# Altium project wirelessBoard II.PrjPcb
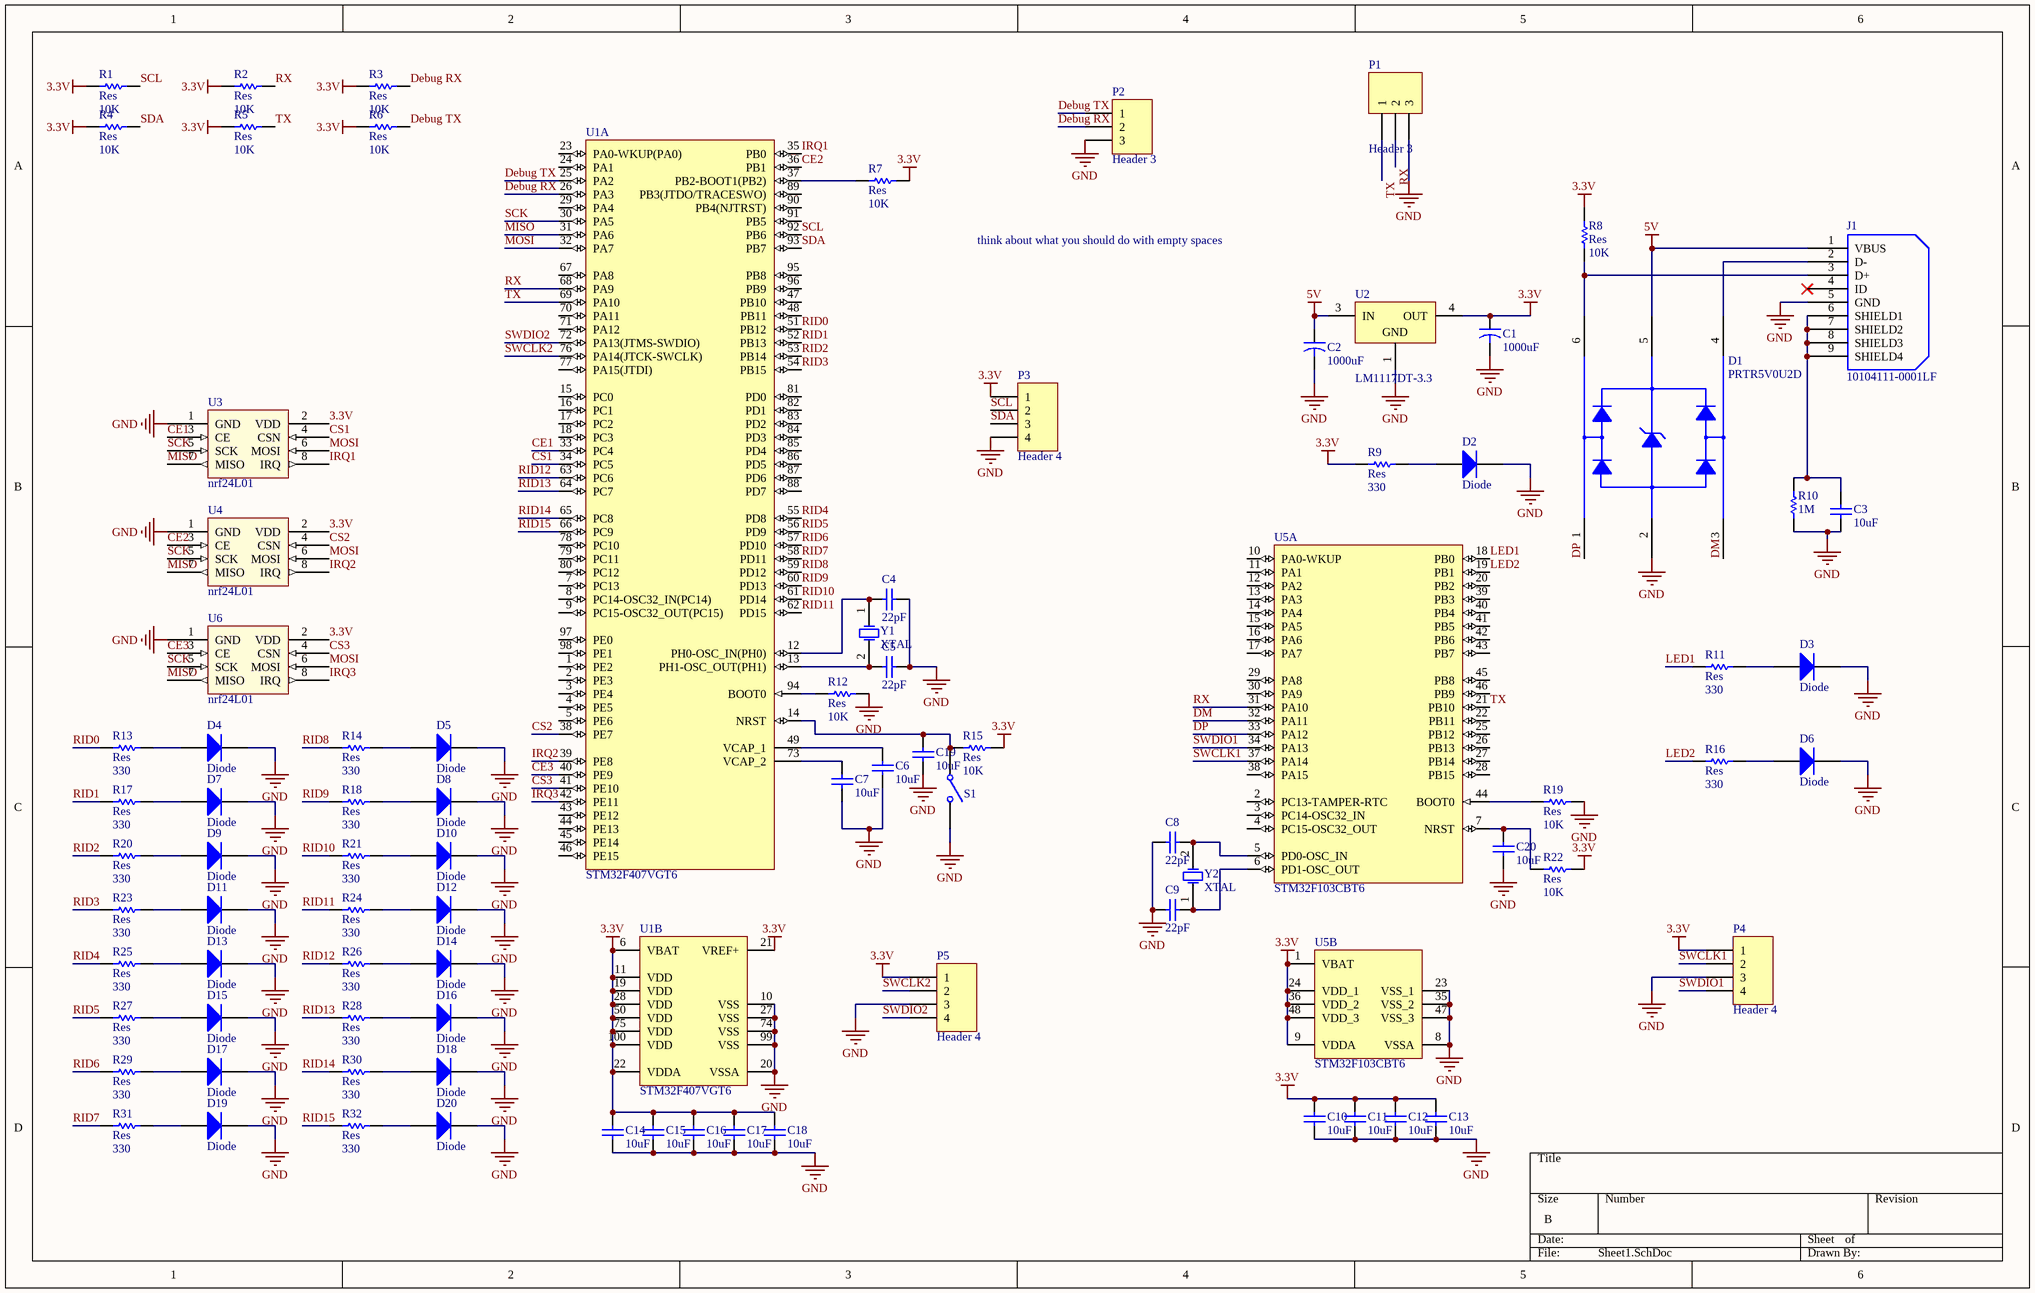
[diagram p0: Sheet1.SchDoc]
1 sheet, 87 parts. Net scope: global (net labels, ports and power ports of the same name join across sheets).
Board file: PCB1.PcbDoc

## Sheet Sheet1.SchDoc
size B

### Parts
C1  value 1000uF  [7343]  (hidden comment: Cap_El)
C2  value 1000uF  [7343]  (hidden comment: Cap_El)
C3  value 10uF  [2012[0805]]  (hidden comment: Cap_UP)
C4  value 22pF  [2012[0805]]  (hidden comment: Cap_UP)
C5  value 22pF  [2012[0805]]  (hidden comment: Cap_UP)
C6  value 10uF  [2012[0805]]  (hidden comment: Cap_UP)
C7  value 10uF  [2012[0805]]  (hidden comment: Cap_UP)
C8  value 22pF  [2012[0805]]  (hidden comment: Cap_UP)
C9  value 22pF  [2012[0805]]  (hidden comment: Cap_UP)
C10  value 10uF  [2012[0805]]  (hidden comment: Cap_UP)
C11  value 10uF  [2012[0805]]  (hidden comment: Cap_UP)
C12  value 10uF  [2012[0805]]  (hidden comment: Cap_UP)
C13  value 10uF  [2012[0805]]  (hidden comment: Cap_UP)
C14  value 10uF  [2012[0805]]  (hidden comment: Cap_UP)
C15  value 10uF  [2012[0805]]  (hidden comment: Cap_UP)
C16  value 10uF  [2012[0805]]  (hidden comment: Cap_UP)
C17  value 10uF  [2012[0805]]  (hidden comment: Cap_UP)
C18  value 10uF  [2012[0805]]  (hidden comment: Cap_UP)
C19  value 10uF  [2012[0805]]  (hidden comment: Cap_UP)
C20  value 10uF  [2012[0805]]  (hidden comment: Cap_UP)
D1  value PRTR5V0U2D  [PRTR5V0U2D]  (hidden comment: PRTR5V0U2X)
D2  Diode  [2012[0805]]
D3  Diode  [2012[0805]]
D4  Diode  [2012[0805]]
D5  Diode  [2012[0805]]
D6  Diode  [2012[0805]]
D7  Diode  [2012[0805]]
D8  Diode  [2012[0805]]
D9  Diode  [2012[0805]]
D10  Diode  [2012[0805]]
D11  Diode  [2012[0805]]
D12  Diode  [2012[0805]]
D13  Diode  [2012[0805]]
D14  Diode  [2012[0805]]
D15  Diode  [2012[0805]]
D16  Diode  [2012[0805]]
D17  Diode  [2012[0805]]
D18  Diode  [2012[0805]]
D19  Diode  [2012[0805]]
D20  Diode  [2012[0805]]
J1  value 10104111-0001LF  [USB_MINI]  (hidden comment: USB_AB)
P1  Header 3  [HDR1X3]
P2  Header 3  [HDR1X3]
P3  Header 4  [HDR1X4]
P4  Header 4  [HDR1X4]
P5  Header 4  [HDR1X4]
R1  Res  value 10K  [2012[0805]]
R2  Res  value 10K  [2012[0805]]
R3  Res  value 10K  [2012[0805]]
R4  Res  value 10K  [2012[0805]]
R5  Res  value 10K  [2012[0805]]
R6  Res  value 10K  [2012[0805]]
R7  Res  value 10K  [2012[0805]]
R8  Res  value 10K  [2012[0805]]
R9  Res  value 330  [2012[0805]]
R10  1M  [2012[0805]]
R11  Res  value 330  [2012[0805]]
R12  Res  value 10K  [2012[0805]]
R13  Res  value 330  [2012[0805]]
R14  Res  value 330  [2012[0805]]
R15  Res  value 10K  [2012[0805]]
R16  Res  value 330  [2012[0805]]
R17  Res  value 330  [2012[0805]]
R18  Res  value 330  [2012[0805]]
R19  Res  value 10K  [2012[0805]]
R20  Res  value 330  [2012[0805]]
R21  Res  value 330  [2012[0805]]
R22  Res  value 10K  [2012[0805]]
R23  Res  value 330  [2012[0805]]
R24  Res  value 330  [2012[0805]]
R25  Res  value 330  [2012[0805]]
R26  Res  value 330  [2012[0805]]
R27  Res  value 330  [2012[0805]]
R28  Res  value 330  [2012[0805]]
R29  Res  value 330  [2012[0805]]
R30  Res  value 330  [2012[0805]]
R31  Res  value 330  [2012[0805]]
R32  Res  value 330  [2012[0805]]
S1  SW-SPST  [SW-SMD]  (value not drawn)
U1  STM32F407VGT6  [STM-LQFP100_N]  (parts A,B of 2)
U2  LM1117DT-3.3  [SOT223]
U3  nrf24L01  [NRF24L01]
U4  nrf24L01  [NRF24L01]
U5  STM32F103CBT6  [STM-LQFP48_N]  (parts A,B of 2)
U6  nrf24L01  [NRF24L01]
Y1  XTAL  [XTALL]
Y2  XTAL  [XTALL]

### Nets
3.3V: C1.1 C10.2 C11.2 C12.2 C13.2 C14.2 C15.2 C16.2 C17.2 C18.2 P3.1 P4.1 P5.1 R1.1 R2.1 R3.1 R4.1 R5.1 R6.1 R7.1 R8.1 R9.1 R15.1 R22.1 U1.6(VBAT) U1.11(VDD) U1.19(VDD) U1.21(VREF+) U1.22(VDDA) U1.28(VDD) U1.50(VDD) U1.75(VDD) U1.100(VDD) U2.4(OUT) U3.2(VDD) U4.2(VDD) U5.1(VBAT) U5.9(VDDA) U5.24(VDD_1) U5.36(VDD_2) U5.48(VDD_3) U6.2(VDD)
5V: C2.1 D1.5(VCC) J1.1(VBUS) U2.3(IN)
GND: C1.2 C2.2 C3.1 C4.2 C5.2 C6.1 C7.1 C8.2 C9.2 C10.1 C11.1 C12.1 C13.1 C14.1 C15.1 C16.1 C17.1 C18.1 C19.1 C20.1 D1.2(GND) D2.2(K) D3.2(K) D4.2(K) D5.2(K) D6.2(K) D7.2(K) D8.2(K) D9.2(K) D10.2(K) D11.2(K) D12.2(K) D13.2(K) D14.2(K) D15.2(K) D16.2(K) D17.2(K) D18.2(K) D19.2(K) D20.2(K) J1.5(GND) P1.3 P2.3 P3.4 P4.3 P5.3 R10.1 R12.2 R19.2 S1.2(NO) U1.10(VSS) U1.20(VSSA) U1.27(VSS) U1.74(VSS) U1.99(VSS) U2.1(GND) U3.1(GND) U4.1(GND) U5.8(VSSA) U5.23(VSS_1) U5.35(VSS_2) U5.47(VSS_3) U6.1(GND)
CE1: U1.33(PC4) U3.3(CE)
CE2: U1.36(PB1) U4.3(CE)
CE3: U1.40(PE9) U6.3(CE)
CS1: U1.34(PC5) U3.4(CSN)
CS2: U1.38(PE7) U4.4(CSN)
CS3: U1.41(PE10) U6.4(CSN)
Debug RX: P2.2 R3.2 U1.26(PA3)
Debug TX: P2.1 R6.2 U1.25(PA2)
DM: D1.3(I/O2) U5.32(PA11)
DP: D1.1(I/O_1) U5.33(PA12)
IRQ1: U1.35(PB0) U3.8(IRQ)
IRQ2: U1.39(PE8) U4.8(IRQ)
IRQ3: U1.42(PE11) U6.8(IRQ)
LED1: R11.1 U5.18(PB0)
LED2: R16.1 U5.19(PB1)
MISO: U1.31(PA6) U3.7(MISO) U4.7(MISO) U6.7(MISO)
MOSI: U1.32(PA7) U3.6(MOSI) U4.6(MOSI) U6.6(MOSI)
RID0: R13.1 U1.51(PB12)
RID1: R17.1 U1.52(PB13)
RID2: R20.1 U1.53(PB14)
RID3: R23.1 U1.54(PB15)
RID4: R25.1 U1.55(PD8)
RID5: R27.1 U1.56(PD9)
RID6: R29.1 U1.57(PD10)
RID7: R31.1 U1.58(PD11)
RID8: R14.1 U1.59(PD12)
RID9: R18.1 U1.60(PD13)
RID10: R21.1 U1.61(PD14)
RID11: R24.1 U1.62(PD15)
RID12: R26.1 U1.63(PC6)
RID13: R28.1 U1.64(PC7)
RID14: R30.1 U1.65(PC8)
RID15: R32.1 U1.66(PC9)
RX: P1.2 R2.2 U1.68(PA9) U5.31(PA10)
SCK: U1.30(PA5) U3.5(SCK) U4.5(SCK) U6.5(SCK)
SCL: P3.2 R1.2 U1.92(PB6)
SDA: P3.3 R4.2 U1.93(PB7)
SWCLK1: P4.2 U5.37(PA14)
SWCLK2: P5.2 U1.76(PA14(JTCK-SWCLK))
SWDIO1: P4.4 U5.34(PA13)
SWDIO2: P5.4 U1.72(PA13(JTMS-SWDIO))
TX: P1.1 R5.2 U1.69(PA10) U5.21(PB10)
NetC3_2: C3.2 J1.6(SHIELD1) J1.7(SHIELD2) J1.8(SHIELD3) J1.9(SHIELD4) R10.2
NetC4_1: C4.1 U1.12(PH0-OSC_IN(PH0)) Y1.1(OSC1)
NetC5_1: C5.1 U1.13(PH1-OSC_OUT(PH1)) Y1.2(OSC2)
NetC6_2: C6.2 U1.49(VCAP_1)
NetC7_2: C7.2 U1.73(VCAP_2)
NetC8_1: C8.1 U5.5(PD0-OSC_IN) Y2.2(OSC2)
NetC9_1: C9.1 U5.6(PD1-OSC_OUT) Y2.1(OSC1)
NetC19_2: C19.2 R15.2 S1.1(COMMON) U1.14(NRST)
NetC20_2: C20.2 R22.2 U5.7(NRST)
NetD1_4: D1.4(I/O2) J1.2(D-)
NetD1_6: D1.6(I/O1) J1.3(D+) R8.2
NetD2_1: D2.1(A) R9.2
NetD3_1: D3.1(A) R11.2
NetD4_1: D4.1(A) R13.2
NetD5_1: D5.1(A) R14.2
NetD6_1: D6.1(A) R16.2
NetD7_1: D7.1(A) R17.2
NetD8_1: D8.1(A) R18.2
NetD9_1: D9.1(A) R20.2
NetD10_1: D10.1(A) R21.2
NetD11_1: D11.1(A) R23.2
NetD12_1: D12.1(A) R24.2
NetD13_1: D13.1(A) R25.2
NetD14_1: D14.1(A) R26.2
NetD15_1: D15.1(A) R27.2
NetD16_1: D16.1(A) R28.2
NetD17_1: D17.1(A) R29.2
NetD18_1: D18.1(A) R30.2
NetD19_1: D19.1(A) R31.2
NetD20_1: D20.1(A) R32.2
NetR7_2: R7.2 U1.37(PB2-BOOT1(PB2))
NetR12_1: R12.1 U1.94(BOOT0)
NetR19_1: R19.1 U5.44(BOOT0)

Not connected (* = marked no-connect by the designer): J1 4(ID)*; U1 1(PE2) 2(PE3) 3(PE4) 4(PE5) 5(PE6) 7(PC13) 8(PC14-OSC32_IN(PC14)) 9(PC15-OSC32_OUT(PC15)) 15(PC0) 16(PC1) 17(PC2) 18(PC3) 23(PA0-WKUP(PA0)) 24(PA1) 29(PA4) 43(PE12) 44(PE13) 45(PE14) 46(PE15) 47(PB10) 48(PB11) 67(PA8) 70(PA11) 71(PA12) 77(PA15(JTDI)) 78(PC10) 79(PC11) 80(PC12) 81(PD0) 82(PD1) 83(PD2) 84(PD3) 85(PD4) 86(PD5) 87(PD6) 88(PD7) 89(PB3(JTDO/TRACESWO)) 90(PB4(NJTRST)) 91(PB5) 95(PB8) 96(PB9) 97(PE0) 98(PE1); U5 2(PC13-TAMPER-RTC) 3(PC14-OSC32_IN) 4(PC15-OSC32_OUT) 10(PA0-WKUP) 11(PA1) 12(PA2) 13(PA3) 14(PA4) 15(PA5) 16(PA6) 17(PA7) 20(PB2) 22(PB11) 25(PB12) 26(PB13) 27(PB14) 28(PB15) 29(PA8) 30(PA9) 38(PA15) 39(PB3) 40(PB4) 41(PB5) 42(PB6) 43(PB7) 45(PB8) 46(PB9)

### Notes on the sheet
- think about what you should do with empty spaces

### Library data of the parts
C1 C2 = Cap_El: Capacitor; Published: 23-Sep-2002; PackageReference: CAPR5-4X5; Publisher: Altium Limited
C3-C20 = Cap_UP: Capacitor; Published: 8-Jun-2000; LatestRevisionDate: 17-Jul-2002; LatestRevisionNote: Re-released for DXP Platform.; PackageReference: RAD-0.3; Publisher: Altium Limited
D1 = PRTR5V0U2D: Double rail-to-rail USB ESD protection diode; OrcadPartType: Integrated Circuits&Special function&Protection; Manufacturer: Philips; AN: A06-0236; TemperatureRange: -40 to +85 C; PartType: Buy; Height: 1,10000002384186; MPN: PRTR5V0U2X
D2-D20 = Diode: 1 Amp General Purpose Rectifier; Revision 1: 11-Jul-2000: SIM Model Added.; Revision 2: 17-Jul-2002: Re-released for DXP Platform.; Package Information: Latest Revision: Aug-1999; Code - JEDEC: DO-204-AL; Published: 8-Jun-2000; Datasheet: Latest Revision: 1998; Package Reference: DO-41; Publisher: Altium Limited
J1 = USB_AB: Micro USB AB Connector; PartGroup: Mechanical devices,Connectors,USB; Manufacturer: FCI; AN: A08-1368; Height: 2.59999990463257; MPN: 10104111-0001LF
P1 P2 = Header 3: Header, 3-Pin; LatestRevisionDate: 17-Jul-2002; LatestRevisionNote: Re-released for DXP Platform.; Publisher: Altium Limited
P3-P5 = Header 4: Header, 4-Pin; LatestRevisionDate: 17-Jul-2002; LatestRevisionNote: Re-released for DXP Platform.; Publisher: Altium Limited
R1-R32 = Res: Semiconductor Resistor; Published: 8-Jun-2000; LatestRevisionDate: 17-Jul-2002; LatestRevisionNote: Re-released for DXP Platform.; PackageReference: AXIAL-0.5; Publisher: Altium Limited
  R10: Value: 1M
S1 = SW-SPST: Single-Pole, Single-Throw Switch; Published: 24-Mar-1999; Revision: July-2002: Re-released for DXP Platform.; Publisher: Altium Limited
U1 = STM32F407VGT6: ARM Cortex-M4 32-bit MCU+FPU, 210 DMIPS, 1024 kB Flash, 192 kB Internal RAM, 82 I/Os, 100-pin LQFP, -40 to 85 degC, Tray; Manufacturer: STMicroelectronics; D/A Converter: 2x12-bit; FLASH Size (Prog) (kB): 1024; I/Os (High Current): 82; Internal RAM Size (kB): 192; Operating Frequency(F) (Processor speed) (MHz): 168; Supply Voltage(Vcc) max (V): 3.6; Supply Voltage(Vcc) min (V): 1.8; DatasheetVersion: Rev. 4; PackageVersion: Rev. 1, 06/2013; PackageReference: LQFP100; PackageDescription: 100-Pin Low Profile Quad Flat Package, 14 x 14 mm Body, 0.5 mm Pitch; Supplier 1: Digi-Key; Supplier Part Number 1: 497-11605-ND; Supplier 2: Farnell; Supplier Part Number 2: 2064368; Supplier 3: Newark; Supplier Part Number 3: 73T2333; Supplier 4: Mouser; Supplier Part Number 4: 511-STM32F407VGT6; Core: ARM Cortex-M4; Packing: Tray; Mounting Technology: Surface Mount; PartNumber: STM32F407VGT6; ComponentLink1Description: Manufacturer URL; ComponentLink1URL: http://www.st.com/web/en/home.html; ComponentLink2Description: Datasheet; ComponentLink2URL: http://www.st.com/st-web-ui/static/active/en/resource/technical/document/datasheet/DM00037051.pdf; ComponentLink3Description: Package Specification; ComponentLink3URL: http://www.st.com/st-web-ui/static/active/en/resource/technical/document/data_brief/DM00071938.pdf
U2 = LM1117DT-3.3: 800mA Low-Dropout Linear Regulator, 3-pin TO-252; Manufacturer: National Semiconductor; PackageTopMarking: NSUZXYTT*LM1117*DT-3.3; PowerWise: N; CompType: LDO IC; Published: 4-Dec-2008; DatasheetVersion: Apr-2006; PackageVersion: revD, Feb-2009; PackageReference: TD03B; Publisher: Altium Limited; PackageDescription: TO252, Molded, Jedec, 6.8 x 6.10 x 2.30mm Body, 3 Lead, 2.28mm Pitch, Surface Mount; Supplier 1: Farnell; Supplier Part Number 1: 9486275; Supplier 2: Farnell; Supplier Part Number 2: 1523829; PartNumber: LM1117DT-3.3; RoHS: N; PinCount: 3; Code_JEDEC: TO-252-AA; ComponentLink1Description: LM1117 Datasheet; ComponentLink1URL: http://www.national.com/ds/LM/LM1117.pdf; ComponentLink2Description: LM1117 Web Page; ComponentLink2URL: http://www.national.com/pf/LM/LM1117.html; ComponentLink3Description: TD03B Package Page; ComponentLink3URL: http://www.national.com/packaging/folders/td03b.html
U5 = STM32F103CBT6: ARM Cortex-M3 32-bit MCU, 128 KB Flash, 20 KB Internal RAM, 37 I/Os, 48-pin LQFP, -40 to 85 degC, Tray; A/D Converter: 2x12-bit (10 Channel); FLASH Size (Prog) (kB): 128; I/Os (High Current): 37; Internal RAM Size (kB): 20; Operating Frequency(F) (Processor speed) (MHz): 72; Supply Voltage(Vcc) min (V): 2; DatasheetVersion: Rev. 16; PackageVersion: Rev. 6, 06/2013; PackageReference: LQFP48; PackageDescription: 48-Pin Low Profile Quad Flat Package, 7 x 7 mm Body, 0.5 mm Pitch; Supplier 1: Digi-Key; Supplier Part Number 1: 497-6288-ND; Supplier 2: Farnell; Supplier Part Number 2: 1606327; Supplier 3: Newark; Supplier Part Number 3: 11N8296; Supplier 4: Newark; Supplier Part Number 4: 57P1214; Supplier 5: Mouser; Supplier Part Number 5: 511-STM32F103CBT6; Core: ARM Cortex-M3; Packing: Tray; Mounting Technology: Surface Mount; PartNumber: STM32F103CBT6; ComponentLink1Description: Manufacturer URL; ComponentLink1URL: http://www.st.com/web/en/home.html; ComponentLink2Description: Datasheet; ComponentLink2URL: http://www.st.com/st-web-ui/static/active/en/resource/technical/document/datasheet/CD00161566.pdf; ComponentLink3Description: Package Specification; ComponentLink3URL: http://www.st.com/st-web-ui/static/active/en/resource/technical/document/datasheet/DM00058181.pdf
Y1 Y2 = XTAL: Crystal Oscillator; Published: 8-Jun-2000; LatestRevisionDate: 17-Jul-2002; LatestRevisionNote: Re-released for DXP Platform.; PackageReference: R38; Publisher: Altium Limited